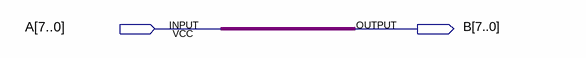
[diagram p0: schematic sheet]
// Quartus schematic line8.bdf as structural Verilog: 0 symbols, 2 pins
module line8 (
  input  [7:0] A,
  output [7:0] B
);


  assign B = A;
endmodule
